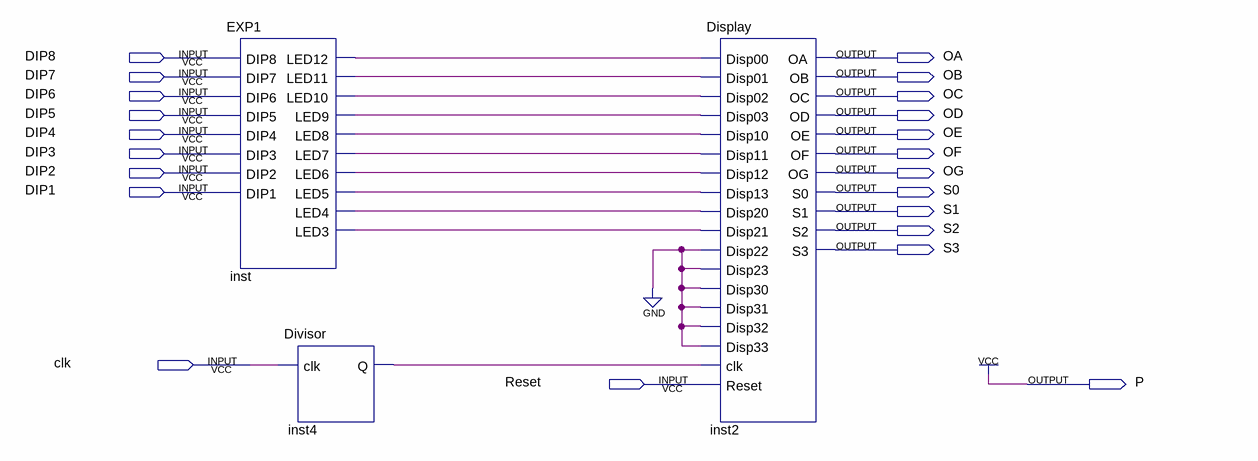
[diagram p0: schematic sheet]
// Quartus schematic PRINCIPAL.bdf as structural Verilog: 3 symbols, 22 pins
module PRINCIPAL (
  input  DIP8,
  input  DIP7,
  input  DIP6,
  input  DIP5,
  input  DIP4,
  input  DIP3,
  input  DIP2,
  input  DIP1,
  input  clk,
  input  Reset,
  output OA,
  output OB,
  output OC,
  output OD,
  output OE,
  output OF,
  output OG,
  output S0,
  output S1,
  output S2,
  output S3,
  output P
);

  wire inst4_q, inst_led3, inst_led4, inst_led5, inst_led6, inst_led7, inst_led8, inst_led9, inst_led10,
       inst_led11, inst_led12;

  EXP1 inst (
    .DIP8(DIP8), .DIP7(DIP7), .DIP6(DIP6), .DIP5(DIP5), .DIP4(DIP4), .DIP3(DIP3), .DIP2(DIP2), .DIP1(DIP1),
    .LED12(inst_led12), .LED11(inst_led11), .LED10(inst_led10), .LED9(inst_led9), .LED8(inst_led8),
    .LED7(inst_led7), .LED6(inst_led6), .LED5(inst_led5), .LED4(inst_led4), .LED3(inst_led3));
  Divisor inst4 (.clk(clk), .Q(inst4_q));
  Display inst2 (
    .Disp00(inst_led12), .Disp01(inst_led11), .Disp02(inst_led10), .Disp03(inst_led9), .Disp10(inst_led8),
    .Disp11(inst_led7), .Disp12(inst_led6), .Disp13(inst_led5), .Disp20(inst_led4), .Disp21(inst_led3),
    .Disp22(1'b0), .Disp23(1'b0), .Disp30(1'b0), .Disp31(1'b0), .Disp32(1'b0), .Disp33(1'b0), .clk(inst4_q),
    .Reset(Reset), .OA(OA), .OB(OB), .OC(OC), .OD(OD), .OE(OE), .OF(OF), .OG(OG), .S0(S0), .S1(S1), .S2(S2),
    .S3(S3));

  assign P = 1'b1;
endmodule
